# EAGLE design FT230X_Breakout (EAGLE 9.3.0)
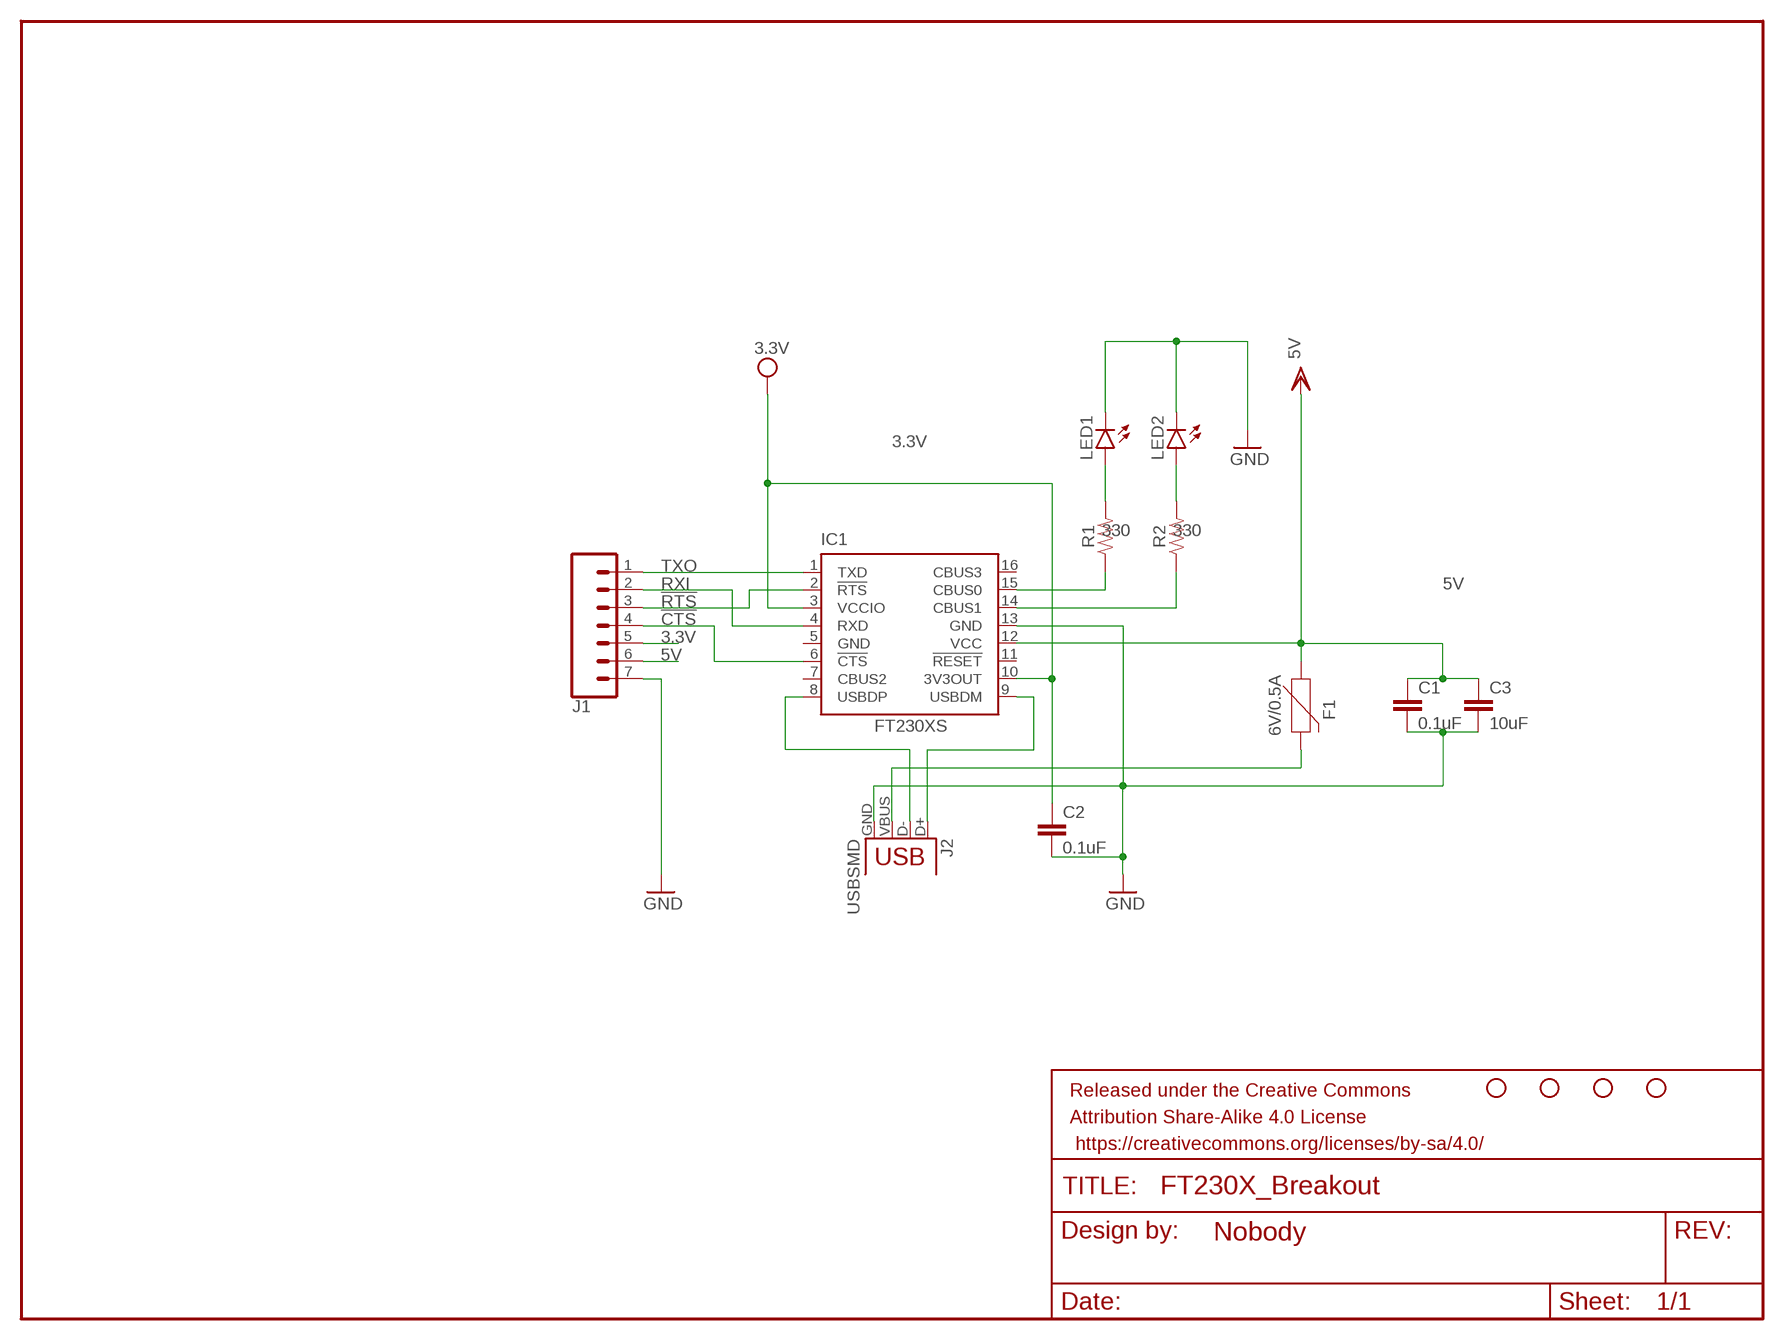
[diagram p0: schematic, sheet 1]

## Parts
C1  0.1uF  CC0603  [C0603]
C2  0.1uF  CC0603  [C0603]
C3  10uF  CC1206  [C1206]
F1  6V/0.5A  PPTC_HALF-AMP  [1206]
FRAME1  FRAME-LETTERNO_PACKAGE  [DUMMY]
H1  STAND-OFF  [STAND-OFF]
H2  STAND-OFF  [STAND-OFF]
H3  STAND-OFF  [STAND-OFF]
H4  STAND-OFF  [STAND-OFF]
IC1  FT230XS  [SSOP16]
J1  CONN_07  [1X07]
J2  USBSMD  [USB-MINIB]
LED1  LEDCHIP-LED0603  [CHIP-LED0603]
LED2  LEDCHIP-LED0603  [CHIP-LED0603]
R1  330  RESISTOR0603  [0603]
R2  330  RESISTOR0603  [0603]

## Nets
3.3V: C2.1 IC1.3(VCCIO) IC1.10(3V3OUT) J1.5
5V: C1.1 C3.1 F1.1 IC1.12(VCC) J1.6
!CTS: IC1.6(!CTS) J1.4
!RTS: IC1.2(!RTS) J1.3
GND: C1.2 C2.2 C3.2 IC1.13(GND) J1.7 J2.GND LED1.C LED2.C
N$1: IC1.9(USBDM) J2.D+
N$2: IC1.8(USBDP) J2.D-
N$3: F1.2 J2.VBUS
N$4: IC1.15(CBUS0) R1.1
N$5: IC1.14(CBUS1) R2.1
N$6: LED1.A R1.2
N$7: LED2.A R2.2
RXI: IC1.4(RXD) J1.2
TXO: IC1.1(TXD) J1.1
Unconnected: IC1.7(CBUS2) IC1.11(!RESET) IC1.16(CBUS3)

## Power pins joined to a net without a drawn wire
GND: IC1.5(GND)

## Library data of the parts
C1-C3 = eagle-ltspice:C: CAPACITOR, European symbol; SPICEMODEL: NONE; SPICEPREFIX: C
F1 = SparkFun-Fuses:PPTC: Resettable Fuse PPTC Resettable Fuse. Really a sort of resistor with a polymeric positive temperature coefficient whose resistance increases dramatically with an increase in temperature. When heated by the power passing through the resistance rises causing the current to be limited, protecting the circuit. This is achieved by the transition of the polymer from a crystalline to an amorphous state where the conductive carbon separates breaking the conductive pathways found in the cool crystalline structure. When a PPTC cools back down it resumes conducting letting the circuit turn back on. SparkFun Products: SparkFun RedBoard - Programmed with Arduino <https://www.sparkfun.com/products/12757> Pro Micro - 5V/16MHz <https://www.sparkfun.com/products/12640> Arduino Pro 328 - 5V/16MHz <https://www.sparkfun.com/products/10915> MP3 Trigger <https://www.sparkfun.com/products/13720>; PROD_ID: RES-08585
FRAME1 = SparkFun-Aesthetics:FRAME-LETTER: Schematic Frame - Letter Standard 8.5x11 US Letter frame; DESIGNER: Nobody; VERSION: v01
H1-H4 = SparkFun-Hardware:STAND-OFF: Stand Off Drill holes for mechanically mounting via screws, standoffs, etc. Note: Use the keepout ring to avoid running the screw head into surrounding components. Variant Overviews STAND-OFF - Mechanical footprint for a #4 phillips button head screw. STAND-OFF-TIGHT - Mechanical footprint for a #4 phillips button head screw, Example SparkFun Products Screw - Phillips Head (1/4", 4-40, 10 pack) <https://www.sparkfun.com/products/10453> (PRT-10453) Screw - Phillips Head (1/2", 4-40, 10 pack) <https://www.sparkfun.com/products/10452> (PRT-10452) Screw - Phillips Head (3/4", 4-40, 10 pack) <https://www.sparkfun.com/products/10451> (PRT-10451) Screw - Phillips Head (1", 4-40, 10 pack) <https://www.sparkfun.com/products/10450> (PRT-10450)
IC1 = ftdichip:FT230X: USB to BASIC UART IC Auto generated by make-symbol-device-package-bsdl.ulp Rev. 43 Source: Data sheet <http://www.ftdichip.com/Support/Documents/DataSheets/ICs/DS_FT230X.pdf>
J1 = SparkFun-Connectors:CONN_07: Multi connection point. Often used as Generic Header-pin footprint for 0.1 inch spaced/style header connections On any of the 0.1 inch spaced packages, you can populate with these: Break Away Headers - Straight <https://www.sparkfun.com/products/116> (PRT-00116) Break Away Male Headers - Right Angle <https://www.sparkfun.com/products/553> (PRT-00553) Female Headers <https://www.sparkfun.com/products/115> (PRT-00115) Break Away Headers - Machine Pin <https://www.sparkfun.com/products/117> (PRT-00117) Break Away Female Headers - Swiss Machine Pin <https://www.sparkfun.com/products/743> (PRT-00743) For SCREWTERMINALS and SPRING TERMINALS visit here: Screw Terimnals on SparkFun.com <https://www.sparkfun.com/search/results?term=Screw+Terminals> (5mm/3.5mm/2.54mm spacing) This device is also useful as a general connection point to wire up your design to another part of your project. Our various solder wires solder well into these plated through hole pads. Hook-Up Wire - Assortment (Stranded, 22 AWG) <https://www.sparkfun.com/products/11375> (PRT-11375) Hook-Up Wire - Assortment (Solid Core, 22 AWG) <https://www.sparkfun.com/products/11367> (PRT-11367) View the entire wire category on our website here <https://www.sparkfun.com/categories/141> Special notes: Molex polarized connector foot print use with SKU : PRT-08231 with associated crimp pins and housings. 1MM SMD Version SKU: PRT-10208 NOTES ON THE VARIANTS LOCK and LOCK_LONGPADS... This footprint was designed to help hold the alignment of a through-hole component (i.e. 6-pin header) while soldering it into place. You may notice that each hole has been shifted either up or down by 0.005 of an inch from it's more standard position (which is a perfectly straight line). This slight alteration caused the pins (the squares in the middle) to touch the edges of the holes. Because they are alternating, it causes a "brace" to hold the component in place. 0.005 has proven to be the perfect amount of "off-center" position when using our standard breakaway headers. Although looks a little odd when you look at the bare footprint, once you have a header in there, the alteration is very hard to notice. Also,if you push a header all the way into place, it is covered up entirely on the bottom side.
J2 = SparkFun-Retired:USB: USB Connectors USB-B-PTH is fully proven SKU : PRT-00139/CONN-08278 USB-miniB is fully proven SKU : PRT-00587 USB-A-PCB is untested. USB-A-H is throughly reviewed, but untested. Spark Fun Electronics SKU : PRT-00437 USB-B-SMT is throughly reviewed, but untested. Needs silkscreen touching up. USB-A-S has not been used/tested USB-MB-H has not been used/tested USB-MICROB has been used. CONN-09505; PROD_ID: CONN-08193
LED1 LED2 = led:LED: LED OSRAM: - CHIPLED LG R971, LG N971, LY N971, LG Q971, LY Q971, LO R971, LY R971 LH N974, LH R974 LS Q976, LO Q976, LY Q976 LO Q996 - Hyper CHIPLED LW Q18S LB Q993, LB Q99A, LB R99A - SideLED LS A670, LO A670, LY A670, LG A670, LP A670 LB A673, LV A673, LT A673, LW A673 LH A674 LY A675 LS A676, LA A676, LO A676, LY A676, LW A676 LS A679, LY A679, LG A679 - Hyper Micro SIDELED® LS Y876, LA Y876, LO Y876, LY Y876 LT Y87S - SmartLED LW L88C, LW L88S LB L89C, LB L89S, LG L890 LS L89K, LO L89K, LY L89K LS L896, LA L896, LO L896, LY L896 - TOPLED LS T670, LO T670, LY T670, LG T670, LP T670 LSG T670, LSP T670, LSY T670, LOP T670, LYG T670 LG T671, LOG T671, LSG T671 LB T673, LV T673, LT T673, LW T673 LH T674 LS T676, LA T676, LO T676, LY T676, LB T676, LH T676, LSB T676, LW T676 LB T67C, LV T67C, LT T67C, LS T67K, LO T67K, LY T67K, LW E67C LS E67B, LA E67B, LO E67B, LY E67B, LB E67C, LV E67C, LT E67C LW T67C LS T679, LY T679, LG T679 LS T770, LO T770, LY T770, LG T770, LP T770 LB T773, LV T773, LT T773, LW T773 LH T774 LS E675, LA E675, LY E675, LS T675 LS T776, LA T776, LO T776, LY T776, LB T776 LHGB T686 LT T68C, LB T68C - Hyper Mini TOPLED® LB M676 - Mini TOPLED Santana® LG M470 LS M47K, LO M47K, LY M47K Source: http://www.osram.convergy.de LUXEON: - LUMILED® LXK2-PW12-R00, LXK2-PW12-S00, LXK2-PW14-U00, LXK2-PW14-V00 LXK2-PM12-R00, LXK2-PM12-S00, LXK2-PM14-U00 LXK2-PE12-Q00, LXK2-PE12-R00, LXK2-PE12-S00, LXK2-PE14-T00, LXK2-PE14-U00 LXK2-PB12-K00, LXK2-PB12-L00, LXK2-PB12-M00, LXK2-PB14-N00, LXK2-PB14-P00, LXK2-PB14-Q00 LXK2-PR12-L00, LXK2-PR12-M00, LXK2-PR14-Q00, LXK2-PR14-R00 LXK2-PD12-Q00, LXK2-PD12-R00, LXK2-PD12-S00 LXK2-PH12-R00, LXK2-PH12-S00 LXK2-PL12-P00, LXK2-PL12-Q00, LXK2-PL12-R00 Source: www.luxeon.com KINGBRIGHT: KA-3528ASYC Source: www.kingbright.com
R1 R2 = SparkFun-Resistors:RESISTOR: Generic Resistor Package

## Board
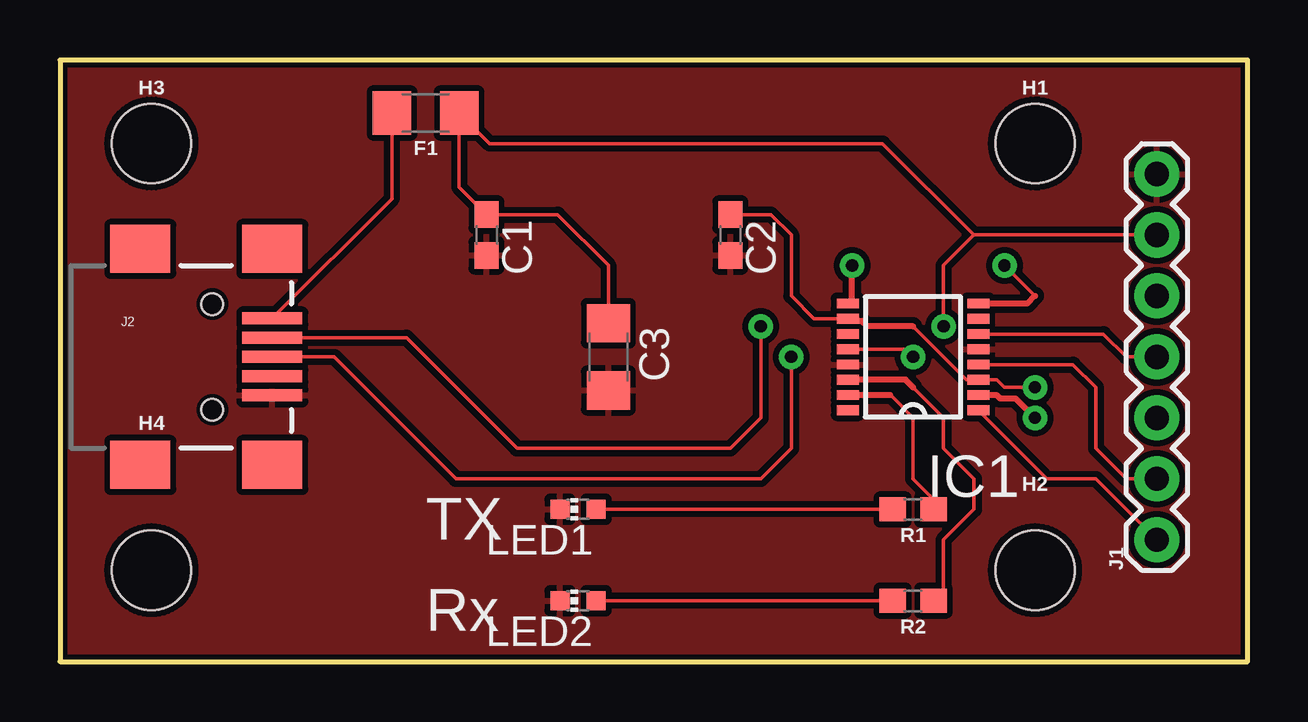
[diagram p1: board, top side]
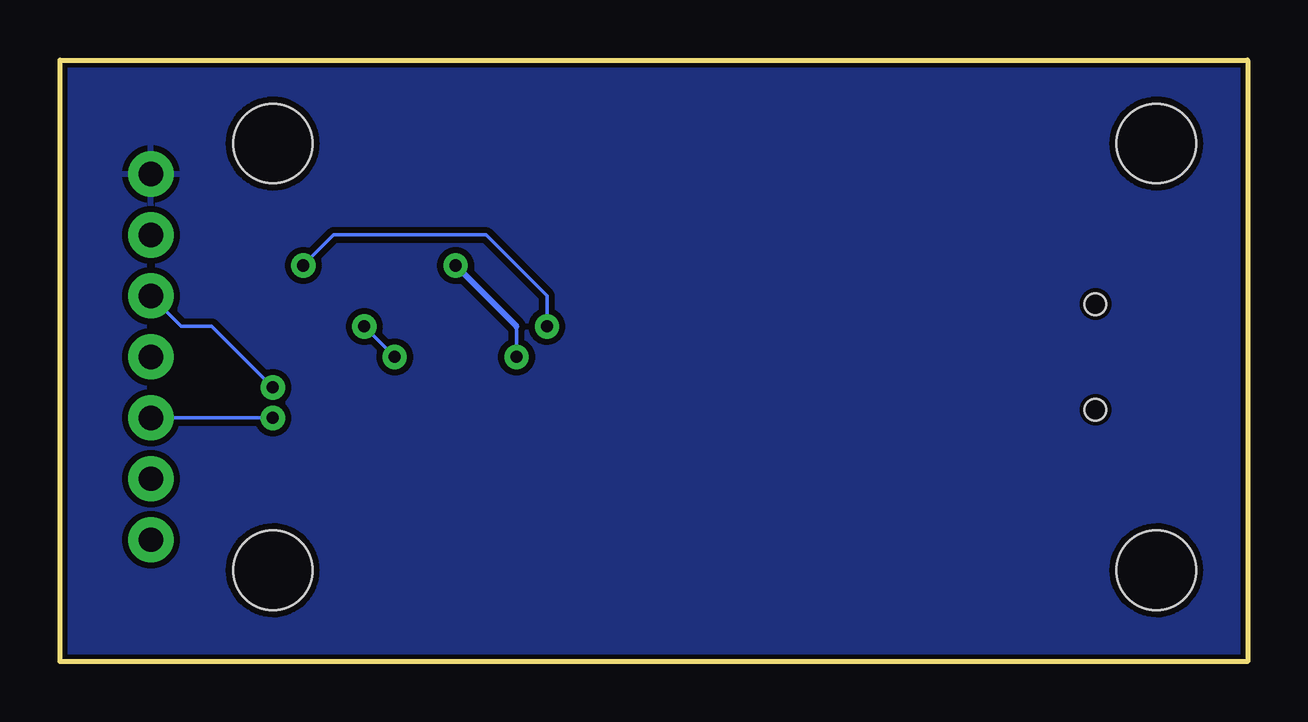
[diagram p2: board, bottom side, seen from below]

Size 49.51 x 25.07 mm. Coordinates in mm from the lower left corner, seen from the top.
Outline: 0,0 49.51,0 49.51,25.07 0,25.07 0,0
Copper layers (1*16): Top 0.035mm / dielectric 1.5mm / Bottom 0.035mm
Design rules "SparkFun-2-layer-STANDARD": minimum track width 10mil, minimum drill 20mil, track to track 10mil, track to pad 8mil, pad to pad 8mil, via to via 10mil, smd to smd 8mil, copper to edge 8mil, drill to drill 8mil, minimum pad ring 10mil, minimum via ring 10mil, stop-mask expansion 4mil, vias tented up to drill 25mil, thermal gap 10mil

### Footprints (pad centres in the part's own frame; a part is rotated, then mirrored left to right if it is on the bottom)
C0603 = smd 1.1 x 1: 1 -0.85,0; 2 0.85,0
C1206 = smd 1.6 x 1.8: 1 -1.4,0; 2 1.4,0
1206 = smd 1.6 x 1.8: 1 -1.4,0; 2 1.4,0
STAND-OFF = hole 3.302: 0,0
SSOP16 = smd 0.914 x 0.406: 1 -2.718,2.223; 2 -2.718,1.587; 3 -2.718,0.953; 4 -2.718,0.318; 5 -2.718,-0.318; 6 -2.718,-0.953; 7 -2.718,-1.587; 8 -2.718,-2.223; 9 2.718,-2.223; 10 2.718,-1.587; 11 2.718,-0.953; 12 2.718,-0.318; 13 2.718,0.318; 14 2.718,0.953; 15 2.718,1.587; 16 2.718,2.223
1X07 = drill 1.016 pad 1.88: 1 0,0; 2 2.54,0; 3 5.08,0; 4 7.62,0; 5 10.16,0; 6 12.7,0; 7 15.24,0
USB-MINIB = smd 2.5 x 0.5: D+ 2.5,0; D- 2.5,0.8; GND 2.5,-1.6; ID 2.5,-0.8; VBUS 2.5,1.6 | smd 2.5 x 2: MTN1 -3,4.5; MTN2 2.5,4.5; MTN3 -3,-4.5; MTN4 2.5,-4.5 | hole 0.9: 0,2.2; 0,-2.2
CHIP-LED0603 = smd 0.8 x 0.8: A 0,-0.75; C 0,0.75
0603 = smd 1.1 x 1: 1 -0.85,0; 2 0.85,0

### Placement (x,y rotation side)
C1  17.78,17.78 270 top
C2  27.94,17.78 270 top
C3  22.86,12.7 270 top
F1  15.24,22.86 180 top
FRAME1  0,0 0 top
H1  40.64,21.59 0 top
H2  40.64,3.81 0 top
H3  3.81,21.59 0 top
H4  3.81,3.81 0 top
IC1  35.56,12.7 180 top
J1  45.72,5.08 90 top
J2  6.35,12.7 0 top
LED1  21.59,6.35 90 top
LED2  21.59,2.54 90 top
R1  35.56,6.35 180 top
R2  35.56,2.54 180 top

### Tracks (layer width: path | path; a pad name or v marks a point on that pad's centre or on a via)
3.3V  (via drill 0.51)
  Top 0.152: C2.1 29.63,18.63 30.48,17.78 30.48,15.24 31.43,14.29 IC1.10 | v40.64,11.43 39.37,11.43 39.05,11.75 IC1.3 37.78,11.75 35.56,13.97
  Top 0.254: IC1.10 32.94,14.19 33.44,14.19 33.65,13.97 35.56,13.97
  Bottom 0.152: J1.5 44.45,13.97 43.18,13.97 v40.64,11.43
5V  (via drill 0.51)
  Top 0.152: C3.1 22.86,16.51 20.74,18.63 C1.1 16.64,19.77 F1.1 17.91,21.59 34.29,21.59 38.1,17.78 | J1.6 38.1,17.78 | 38.1,17.78 36.83,16.51 v36.83,13.97 | v35.56,12.7 35.24,13.02 IC1.12
  Bottom 0.152: v36.83,13.97 v35.56,12.7
!CTS
  Top 0.152: IC1.6 43.5,13.65 44.45,12.7 J1.4
!RTS  (via drill 0.51)
  Top 0.254: IC1.2 39.04,11.11 39.18,10.97 39.83,10.97 v40.64,10.16
  Bottom 0.152: J1.3 v40.64,10.16
GND
  pour Top: 0,0 0,25.4 49.53,25.4 49.53,0
  pour Bottom: 0,0 0,25.4 49.53,25.4 49.53,0
N$1  (via drill 0.51)
  Top 0.152: J2.D+ 11.43,12.7 16.51,7.62 29.21,7.62 30.48,8.89 v30.48,12.7
  Top 0.254: IC1.9 33.02,15.1 v33.02,16.51
  Bottom 0.152: v30.48,12.7 30.48,13.97
  Bottom 0.254: 30.48,13.97 v33.02,16.51
N$2  (via drill 0.51)
  Top 0.152: J2.D- 14.44,13.5 19.05,8.89 27.94,8.89 29.21,10.16 v29.21,13.97 | v39.37,16.51 40.64,15.24
  Top 0.254: 40.64,15.24 40.32,14.92 IC1.8
  Bottom 0.152: v29.21,13.97 29.21,15.24 31.75,17.78 38.1,17.78 v39.37,16.51
N$3
  Top 0.152: J2.VBUS 13.84,19.29 F1.2
N$4
  Top 0.152: 34.61,11.11 35.56,10.16 35.56,7.62 36.41,6.77 R1.1
  Top 0.254: IC1.15 34.61,11.11
N$5
  Top 0.152: 35.56,11.43 36.83,10.16 36.83,8.89 38.1,7.62 38.1,6.35 36.83,5.08 36.83,2.96 R2.1
  Top 0.254: 35.56,11.43 35.24,11.75 IC1.14
N$6
  Top 0.152: R1.2 LED1.A
N$7
  Top 0.152: R2.2 LED2.A
RXI
  Top 0.152: IC1.4 42.23,12.38 43.18,11.43 43.18,8.89 44.45,7.62 J1.2
TXO
  Top 0.152: IC1.1 41.13,7.62 43.18,7.62 J1.1

### Text on the board
tPlace: TX | Rx